# Altium schematic sheet program_counter.schdoc
size 194 x 148 mm
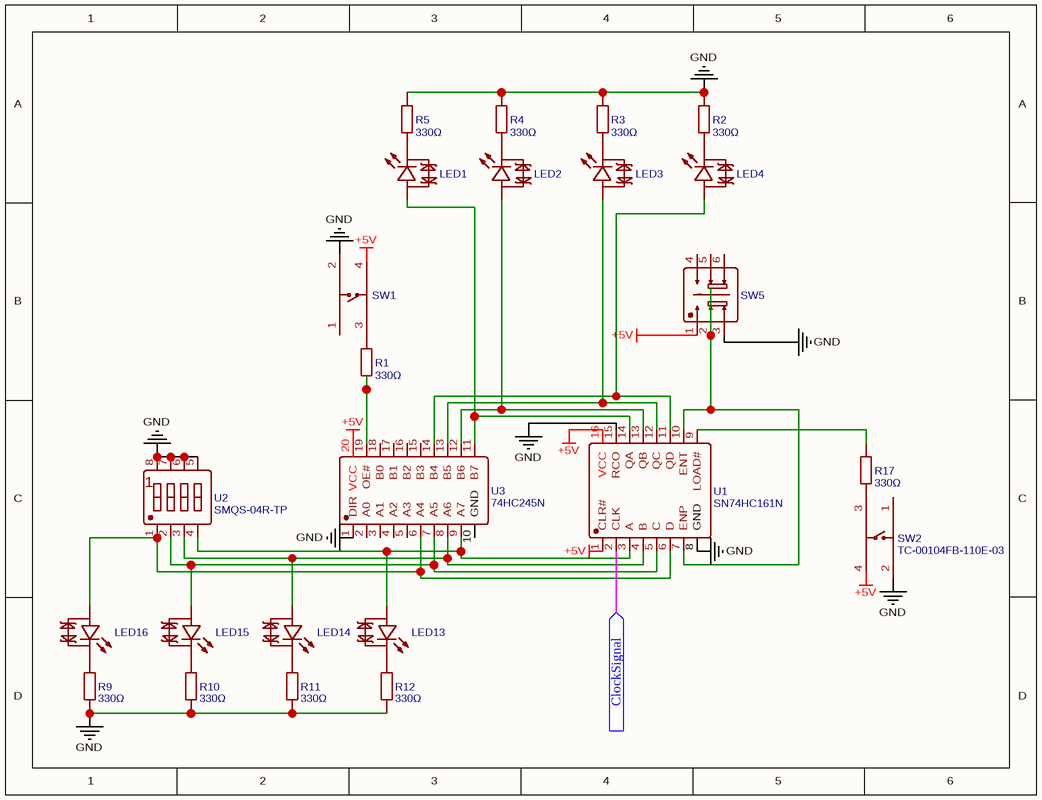
[diagram p0: program_counter.schdoc]

## Parts
LED1  204-15UTC/S400-X9-L  [LED-TH_BD3.0-P2.54-FD]  (value not drawn)
LED2  204-15UTC/S400-X9-L  [LED-TH_BD3.0-P2.54-FD]  (value not drawn)
LED3  204-15UTC/S400-X9-L  [LED-TH_BD3.0-P2.54-FD]  (value not drawn)
LED4  204-15UTC/S400-X9-L  [LED-TH_BD3.0-P2.54-FD]  (value not drawn)
LED13  204-15UTC/S400-X9-L  [LED-TH_BD3.0-P2.54-FD]  (value not drawn)
LED14  204-15UTC/S400-X9-L  [LED-TH_BD3.0-P2.54-FD]  (value not drawn)
LED15  204-15UTC/S400-X9-L  [LED-TH_BD3.0-P2.54-FD]  (value not drawn)
LED16  204-15UTC/S400-X9-L  [LED-TH_BD3.0-P2.54-FD]  (value not drawn)
R1  330Ω  [RES-TH_BD3.3-L9.0-P13.00-D0.6]
R2  330Ω  [RES-TH_BD3.3-L9.0-P13.00-D0.6]
R3  330Ω  [RES-TH_BD3.3-L9.0-P13.00-D0.6]
R4  330Ω  [RES-TH_BD3.3-L9.0-P13.00-D0.6]
R5  330Ω  [RES-TH_BD3.3-L9.0-P13.00-D0.6]
R9  330Ω  [RES-TH_BD3.3-L9.0-P13.00-D0.6]
R10  330Ω  [RES-TH_BD3.3-L9.0-P13.00-D0.6]
R11  330Ω  [RES-TH_BD3.3-L9.0-P13.00-D0.6]
R12  330Ω  [RES-TH_BD3.3-L9.0-P13.00-D0.6]
R17  330Ω  [RES-TH_BD3.3-L9.0-P13.00-D0.6]
SW1  TC-00104FB-110E-03  [SW-TH_4P-L6.0-W6.0-P4.50-LS6.5]  (value not drawn)
SW2  TC-00104FB-110E-03  [SW-TH_4P-L6.0-W6.0-P4.50-LS6.5]
SW5  XKB8585-Z-190  [SW-TH_6P-L8.6-W8.6-P2.50-LS5.4]  (value not drawn)
U1  SN74HC161N  [PDIP-16_L19.3-W6.4-P2.54-LS7.9-BL]
U2  SMQS-04R-TP  [SW-TH_8P-P2.54_SMQS-04R-TP]
U3  74HC245N  [DIP-20_L26.8-W6.4-P2.54-LS7.6-BL]

## Ports
ClockSignal (in)

## Nets
+5V: SW5.1 U1.1(CLR#) U1.16(VCC) U3.20(VCC)
GND: R2.2 R3.2 R4.2 R5.2 R9.2 R10.2 R11.2 R12.2 SW1.2 SW2.2 SW5.3 U1.8(GND) U1.15(RCO) U2.5(PIN5) U2.6(PIN6) U2.7(PIN7) U2.8(PIN8) U3.1(DIR)
ClockSignal: U1.2(CLK) ; port ClockSignal
NetLED1_1: LED1.1(A) U1.14(QA) U3.11(B7)
NetLED1_2: LED1.2(C) R5.1
NetLED2_1: LED2.1(A) U1.13(QB) U3.12(B6)
NetLED2_2: LED2.2(C) R4.1
NetLED3_1: LED3.1(A) U1.12(QC) U3.13(B5)
NetLED3_2: LED3.2(C) R3.1
NetLED4_1: LED4.1(A) U1.11(QD) U3.14(B4)
NetLED4_2: LED4.2(C) R2.1
NetLED13_1: LED13.1(A) U1.3(A) U2.4(PIN4) U3.9(A7)
NetLED13_2: LED13.2(C) R12.1
NetLED14_1: LED14.1(A) U1.4(B) U2.3(PIN3) U3.8(A6)
NetLED14_2: LED14.2(C) R11.1
NetLED15_1: LED15.1(A) U1.5(C) U2.2(PIN2) U3.7(A5)
NetLED15_2: LED15.2(C) R10.1
NetLED16_1: LED16.1(A) U1.6(D) U2.1(PIN1) U3.6(A4)
NetLED16_2: LED16.2(C) R9.1
NetR1_1: R1.1 U3.19(OE#)
NetR1_2: R1.2 SW1.3
NetR17_1: R17.1 U1.9(LOAD#)
NetR17_2: R17.2 SW2.3
NetSW5_2: SW5.2 U1.7(ENP) U1.10(ENT)

Not connected (* = marked no-connect by the designer): SW1 1 4; SW2 1 4; SW5 4 5 6; U3 2(A0) 3(A1) 4(A2) 5(A3) 10(GND) 15(B3) 16(B2) 17(B1) 18(B0)

## Notes on the sheet
- Labels drawn without touching a wire or pin: +5V

## Library data of the parts
LED1-LED4 LED13-LED16 = 204-15UTC/S400-X9-L: Manufacturer: EVERLIGHT(亿光); Contributor: LCSC; Supplier: LCSC; Supplier Part: C282138; Manufacturer Part: 204-15UTC/S400-X9-L; JLCPCB Part Class: Extended Part; spicePre: L; spiceSymbolName: 204-15UTC/S400-X9-L
R1-R5 R9-R12 R17 = 330Ω: Manufacturer: CCO(千志电子); Manufacturer Part: MF1/2W-0.1Ω±1% T; nameAlias: Value; Contributor: LCSC; Supplier: LCSC; Supplier Part: C119393; JLCPCB Part Class: Extended Part; spicePre: R; spiceSymbolName: MF1/2W-0.1Ω±1% T52
SW1 SW2 = TC-00104FB-110E-03: Manufacturer: HOOYA(皓宇电子); Contributor: lcsc; Supplier: LCSC; Supplier Part: C7542981; Manufacturer Part: TC-00104FB-110E-03; JLCPCB Part Class: Extended Part; spicePre: S; spiceSymbolName: TC-00104FB-110E-03
SW5 = XKB8585-Z-190: Manufacturer: XKB Connectivity(中国星坤); Contributor: LCSC; Supplier: LCSC; Supplier Part: C318849; Manufacturer Part: XKB8585-Z-190; JLCPCB Part Class: Extended Part; spicePre: S; spiceSymbolName: XKB8585-Z-190
U1 = SN74HC161N: Manufacturer: TI(德州仪器); Contributor: lcsc; Supplier: LCSC; Supplier Part: C273647; Manufacturer Part: SN74HC161N; JLCPCB Part Class: Extended Part; spicePre: U; spiceSymbolName: SN74HC161N
U2 = SMQS-04R-TP: Manufacturer: SM Switch; Contributor: lcsc; Supplier: LCSC; Supplier Part: C5299505; Manufacturer Part: SMQS-04R-TP; JLCPCB Part Class: Extended Part; spicePre: U; spiceSymbolName: SMQS-04R-TP
U3 = 74HC245N: Manufacturer: HGSEMI(华冠); Contributor: LCSC; Supplier: LCSC; Supplier Part: C507182; Manufacturer Part: 74HC245N; JLCPCB Part Class: Extended Part; spicePre: U; spiceSymbolName: 74HC245N